# Altium schematic sheet 01_COVER.SchDoc
size A4; CheckedBy: Inženjer 2; CompanyName: Byte Lab Grupa d.o.o.; Engineer: Matija Puskar; Organization: Byte Lab Grupa d.o.o.; Address1: Medarska 69/1, 10000 Zagreb, Croatia; DocumentNumber: 1; SheetNumber: 1; SheetTotal: 7; Web: www.byte-lab.com; ProjectName: P1X-0XX
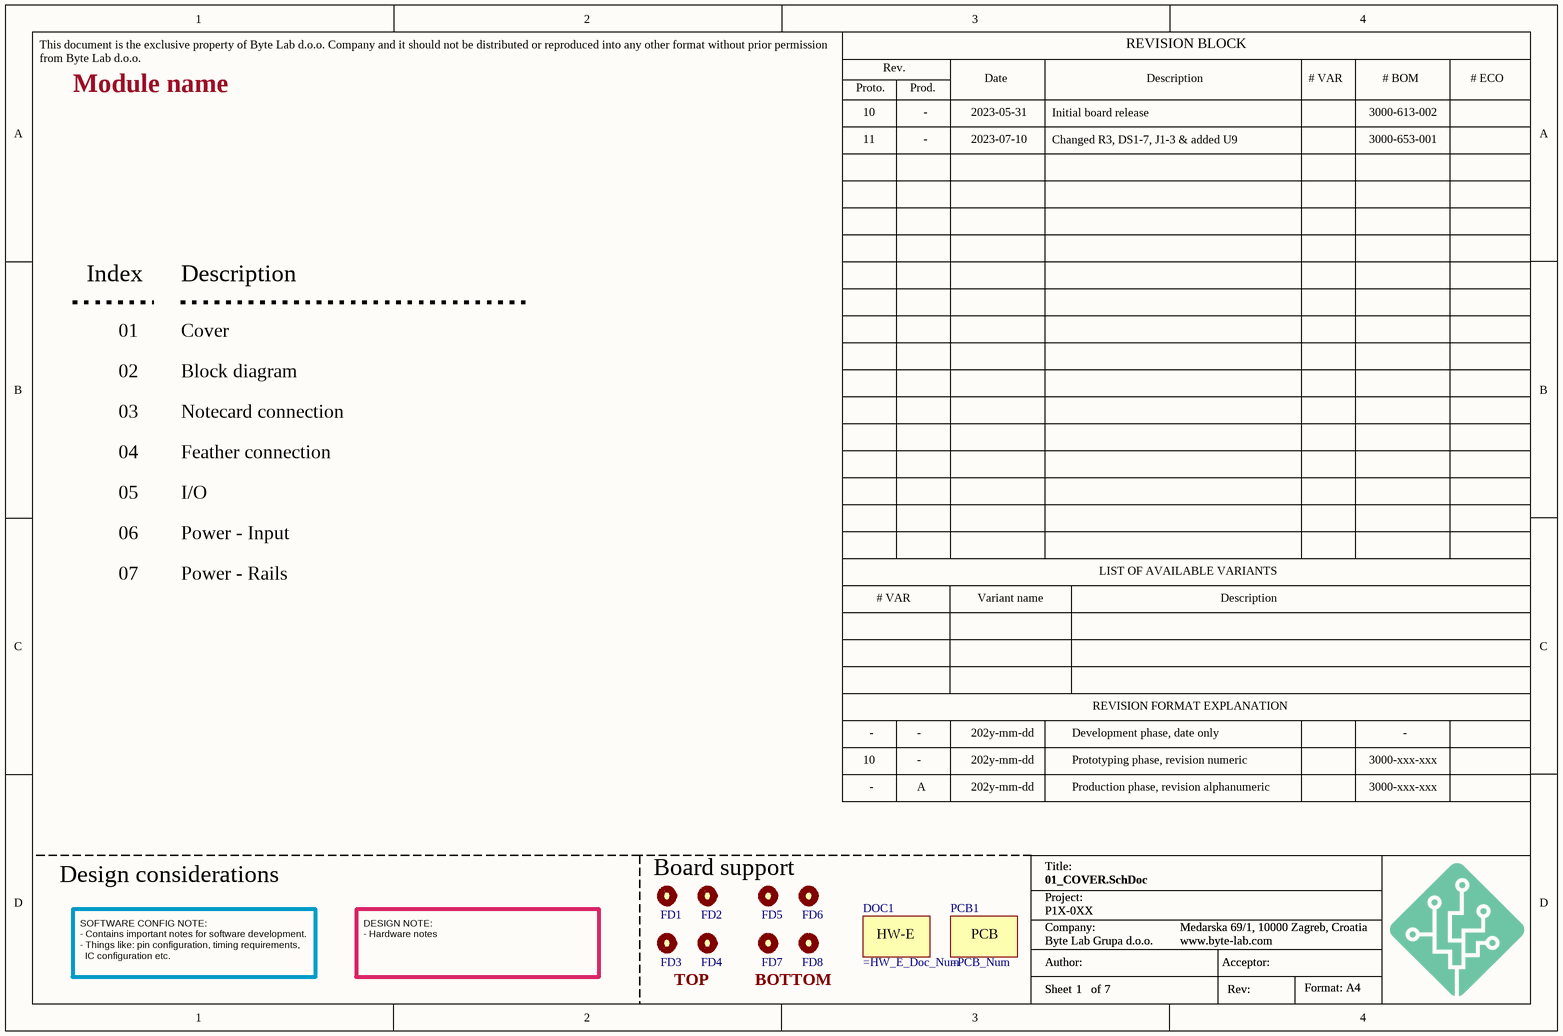
[diagram p0: 01_COVER.SchDoc]

## Parts
DOC1  Electronic design doc number  (value not drawn)  (mechanical)
FD1  Fiducial mark  [Fiducial mark 1mm]  (value not drawn)  (no BOM)
FD2  Fiducial mark  [Fiducial mark 1mm]  (value not drawn)  (no BOM)
FD3  Fiducial mark  [Fiducial mark 1mm]  (value not drawn)  (no BOM)
FD4  Fiducial mark  [Fiducial mark 1mm]  (value not drawn)  (no BOM)
FD5  Fiducial mark  [Fiducial mark 1mm]  (value not drawn)  (no BOM)
FD6  Fiducial mark  [Fiducial mark 1mm]  (value not drawn)  (no BOM)
FD7  Fiducial mark  [Fiducial mark 1mm]  (value not drawn)  (no BOM)
FD8  Fiducial mark  [Fiducial mark 1mm]  (value not drawn)  (no BOM)
PCB1  PCB Part Number  (value not drawn)  (mechanical)

## Nets

Not connected (* = marked no-connect by the designer): FD1 1; FD2 1; FD3 1; FD4 1; FD5 1; FD6 1; FD7 1; FD8 1

## Notes on the sheet
- Module name
- 10
- -
- 2023-05-31
- 3000-613-002
- 11
- 2023-07-10
- Initial board release
- Changed R3, DS1-7, J1-3 & added U9
- 3000-653-001
- Index
- Description
- 01
- 02
- Cover
- Block diagram
- 03
- Notecard connection
- 04
- 05
- Feather connection
- I/O
- 06
- 07
- Power - Input
- Power - Rails
- Design considerations
- Board support
- SOFTWARE CONFIG NOTE:
  - Contains important notes for software development.
  - Things like: pin configuration, timing requirements,
  IC configuration etc.
- DESIGN NOTE:
  - Hardware notes
- TOP
- BOTTOM
- This document is the exclusive property of Byte Lab d.o.o. Company and it should not be distributed or reproduced into any other format without prior permission
- from Byte Lab d.o.o.
- Proto.
- Rev.
- Prod.
- Date
- REVISION BLOCK
- # VAR
- # BOM
- # ECO
- LIST OF AVAILABLE VARIANTS
- Variant name
- REVISION FORMAT EXPLANATION
- A
- 202y-mm-dd
- Development phase, date only
- Prototyping phase, revision numeric
- Production phase, revision alphanumeric
- 3000-xxx-xxx
- Project:
- Title:
- Author:
- Company:
- Acceptor:
- Format: A4
- Sheet
- of
- Rev:
- (in symbol PN_HW-E) HW-E
- (in symbol PN_PCB) PCB

## Library data of the parts
DOC1 = PN_HW-E: Manufacturer: Byte Lab; Checked_By: Zvonc; Drawn_By: Dodig; Manufacturer Part Number: *; DateModified: *; Note: *; BL Part Number: =HW_E_Doc_Num
FD1-FD8 = Fiducial mark: Drawn_By: Puskar; Checked_By: Dodig; BL Part Number: N/A; Note: *; Manufacturer: N/A; Manufacturer Part Number: N/A; DateModified: 17-06-2013
PCB1 = PN_PCB: Manufacturer: Byte Lab; Checked_By: Zvonc; Drawn_By: Dodig; Manufacturer Part Number: *; DateModified: *; Note: *; BL Part Number: =PCB_Num